# Altium schematic sheet main_board_with_74als680.SchDoc
size A3
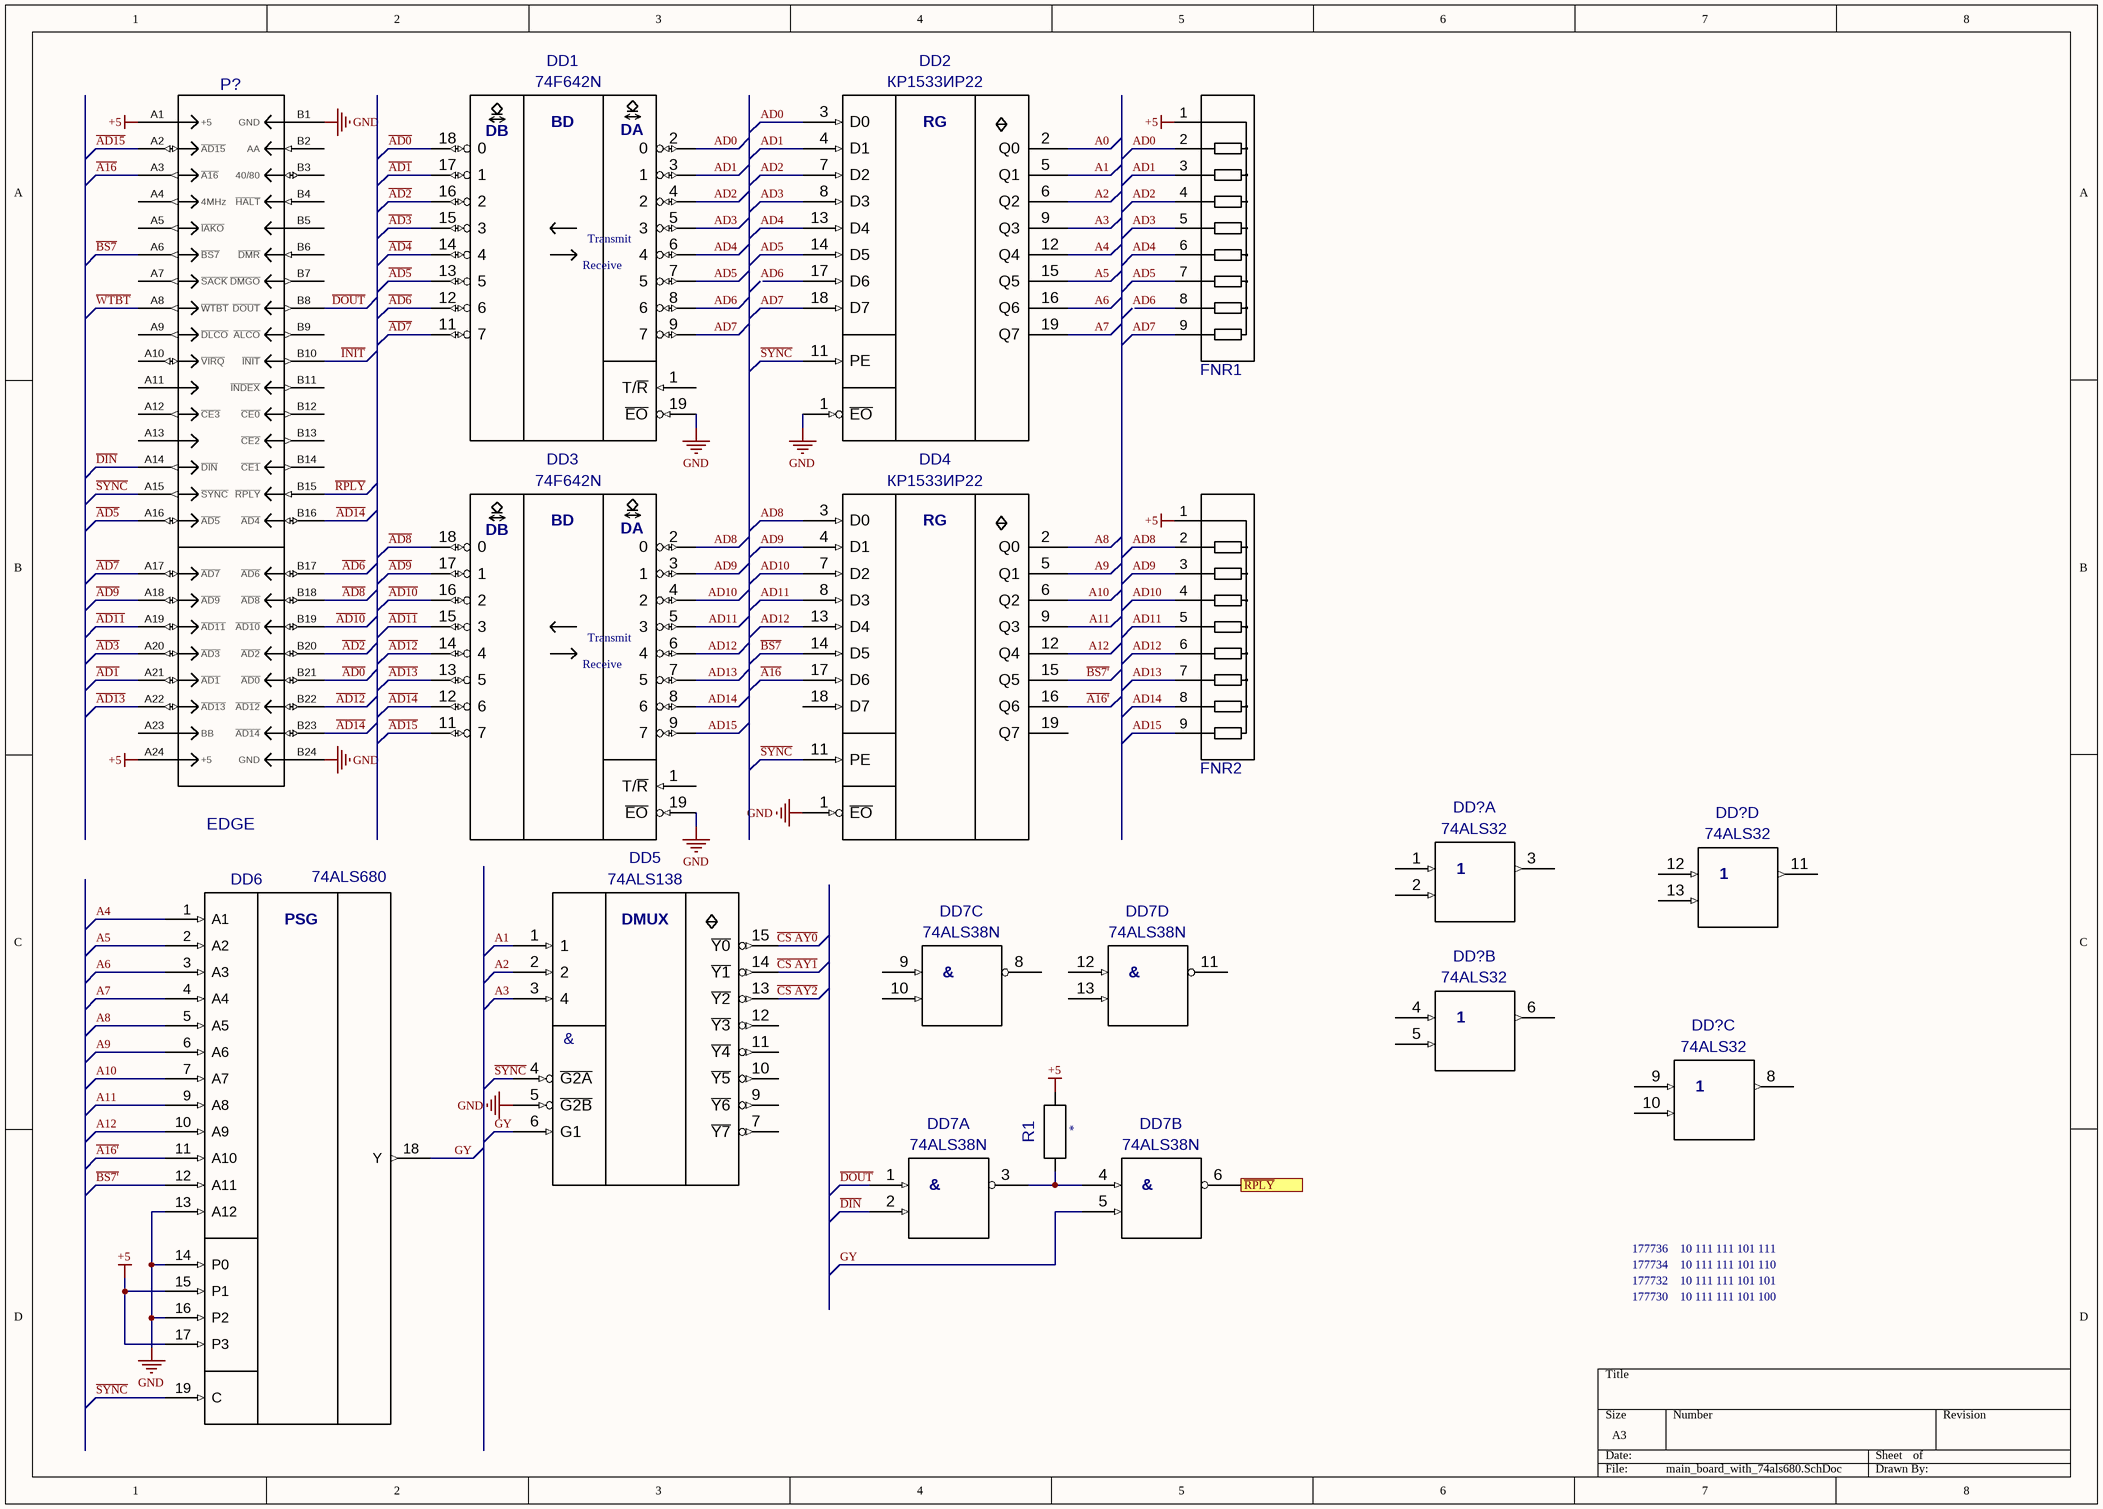
[diagram p0: main_board_with_74als680.SchDoc]

## Parts
(Parts that share a designator on the sheet are numbered #1, #2 ... from top to bottom, then left to right.)
DD1  74F642N  [DIP20]
DD2  КР1533ИР22  [DIP20]
DD3  74F642N  [DIP20]
DD4  КР1533ИР22  [DIP20]
DD5  74ALS138  [DIP16]
DD6  74ALS680  [DIP20]
DD7  74ALS38N  [DIP14]  (parts A,B,C,D of 4)
DD?#1  74ALS32  [DIP14]  (part A of 4)
DD?#2  74ALS32  [DIP14]  (part D of 4)
DD?#3  74ALS32  [DIP14]  (part B of 4)
DD?#4  74ALS32  [DIP14]  (part C of 4)
FNR1  FNR8  [FNR8]  (value not drawn)
FNR2  FNR8  [FNR8]  (value not drawn)
P?  EDGE  [SNP15-48 EDGE]
R1  R0125A  [R0125A]  (value not drawn)

## Ports
~{RPLY} (out)

## Nets
+5: DD6.15(P1) DD6.17(P3) FNR1.1 FNR2.1 P?.A1(+5) P?.A24(+5) R1.2(I/OB)
GND: DD1.19(~{EO}) DD2.1(~{EO}) DD3.19(~{EO}) DD4.1(~{EO}) DD5.5(~{G2B}) DD6.13(A12) DD6.14(P0) DD6.16(P2) P?.B1(GND) P?.B24(GND)
A0: DD2.2(Q0)
A1: DD2.5(Q1) DD5.1
A2: DD2.6(Q2) DD5.2
A3: DD2.9(Q3) DD5.3(4)
A4: DD2.12(Q4) DD6.1(A1)
A5: DD2.15(Q5) DD6.2(A2)
A6: DD2.16(Q6) DD6.3(A3)
A7: DD2.19(Q7) DD6.4(A4)
A8: DD4.2(Q0) DD6.5(A5)
A9: DD4.5(Q1) DD6.6(A6)
A10: DD4.6(Q2) DD6.7(A7)
A11: DD4.9(Q3) DD6.9(A8)
A12: DD4.12(Q4) DD6.10(A9)
~{A16}: DD4.17(D6) P?.A3(~{A16})
~{A16'}: DD4.16(Q6) DD6.11(A10)
~{AD0}: DD1.18(0) P?.B21(~{AD0})
~{AD1}: DD1.17(1) P?.A21(~{AD1})
~{AD10}: DD3.16(2) P?.B19(~{AD10})
~{AD11}: DD3.15(3) P?.A19(~{AD11})
~{AD12}: DD3.14(4) P?.B22(~{AD12})
~{AD13}: DD3.13(5) P?.A22(~{AD13})
~{AD14}: DD3.12(6) P?.B16(~{AD4}) P?.B23(~{AD14})
~{AD15}: DD3.11(7) P?.A2(~{AD15})
~{AD2}: DD1.16(2) P?.B20(~{AD2})
~{AD3}: DD1.15(3) P?.A20(~{AD3})
~{AD4}: DD1.14(4)
~{AD5}: DD1.13(5) P?.A16(~{AD5})
~{AD6}: DD1.12(6) P?.B17(~{AD6})
~{AD7}: DD1.11(7) P?.A17(~{AD7})
~{AD8}: DD3.18(0) P?.B18(~{AD8})
~{AD9}: DD3.17(1) P?.A18(~{AD9})
AD0: DD1.2(0) DD2.3(D0) FNR1.2
AD1: DD1.3(1) DD2.4(D1) FNR1.3
AD2: DD1.4(2) DD2.7(D2) FNR1.4
AD3: DD1.5(3) DD2.8(D3) FNR1.5
AD4: DD1.6(4) DD2.13(D4) FNR1.6
AD5: DD1.7(5) DD2.14(D5) FNR1.7
AD6: DD1.8(6)
AD7: DD1.9(7) DD2.18(D7) FNR1.9
AD8: DD3.2(0) DD4.3(D0) FNR2.2
AD9: DD3.3(1) DD4.4(D1) FNR2.3
AD10: DD3.4(2) DD4.7(D2) FNR2.4
AD11: DD3.5(3) DD4.8(D3) FNR2.5
AD12: DD3.6(4) DD4.13(D4) FNR2.6
AD13: DD3.7(5) FNR2.7
AD14: DD3.8(6) FNR2.8
AD15: DD3.9(7) FNR2.9
~{BS7}: DD4.14(D5) P?.A6(~{BS7})
~{BS7'}: DD4.15(Q5) DD6.12(A11)
~{CS AY0}: DD5.15(~{Y0})
~{CS AY1}: DD5.14(~{Y1})
~{CS AY2}: DD5.13(~{Y2})
~{DIN}: DD7.2 P?.A14(~{DIN})
~{DOUT}: DD7.1 P?.B8(~{DOUT})
GY: DD5.6(G1) DD6.18(Y) DD7.5
~{INIT}: P?.B10(~{INIT})
~{RPLY}: DD7.6 ; port ~{RPLY}
~{RPLY}: P?.B15(~{RPLY})  [a separate net that carries the same name]
~{SYNC}: DD2.11(PE) DD4.11(PE) DD5.4(~{G2A}) DD6.19(C) P?.A15(~{SYNC})
~{WTBT}: P?.A8(~{WTBT})
NetDD7_3: DD7.3 DD7.4 R1.1(I/OA)

Not connected (* = marked no-connect by the designer): DD1 1(T/~{R}) 10(GND) 20(Vcc); DD2 10(GND) 17(D6) 20(+5V); DD3 1(T/~{R}) 10(GND) 20(Vcc); DD4 10(GND) 18(D7) 19(Q7) 20(+5V); DD5 7(~{Y7}) 8(GND) 9(~{Y6}) 10(~{Y5}) 11(~{Y4}) 12(~{Y3}) 16(+5); DD6 8(GND) 20(+5); DD7 7(GND) 8 9 10 11 12 13 14(+5); DD?#1 1 2 3 7(GND) 14(+5V); DD?#2 7(GND) 11 12 13 14(+5V); DD?#3 4 5 6 7(GND) 14(+5V); DD?#4 7(GND) 8 9 10 14(+5V); FNR1 8; P? A4(4MHz) A5(~{IAKO}) A7(~{SACK}) A9(~{DLCO}) A10(~{VIRQ}) A11 A12(~{CE3}) A13 A23(BB) B2(AA) B3(40/80) B4(~{HALT}) B5 B6(~{DMR}) B7(~{DMGO}) B9(~{ALCO}) B11(~{INDEX}) B12(~{CE0}) B13(~{CE2}) B14(~{CE1})

## Notes on the sheet
- 177736
- 10 111 111 101 111
- 177734
- 177732
- 177730
- 10 111 111 101 110
- 10 111 111 101 101
- 10 111 111 101 100
- Labels drawn without touching a wire or pin: AD6
- (in symbol 74ALS38N, part A) &
- (in symbol 74ALS38N, part B) &
- (in symbol 74ALS38N, part C) &
- (in symbol 74ALS38N, part D) &
- (in symbol 74ALS138) DMUX; &
- (in symbol 74ALS680) PSG
- (in symbol 74F642N) BD; DA; DB; Transmit; Receive
- (in symbol КР1533ИР22(74ALS373)) RG

## Library data of the parts
DD2 DD4 = КР1533ИР22(74ALS373): Value: *
DD5 = 74ALS138: КР1533ИД7; Value: *
DD6 = 74ALS680: Address comparator with latch; Value: *
DD7 = 74ALS38N: КР1533ЛА13; Value: *
DD?#1-DD?#4 = 74ALS32: КР1533ЛЛ1; Value: *
P? = SNP15-48 EDGE: Value: *
R1 = R0125A: PDIF_TY: 11107; Value: *
DD1 DD3 = 74F642N: Value: *